# Altium schematic sheet POWER_SUPPLY.SchDoc
size A4; SheetNumber: 1; SheetTotal: 3
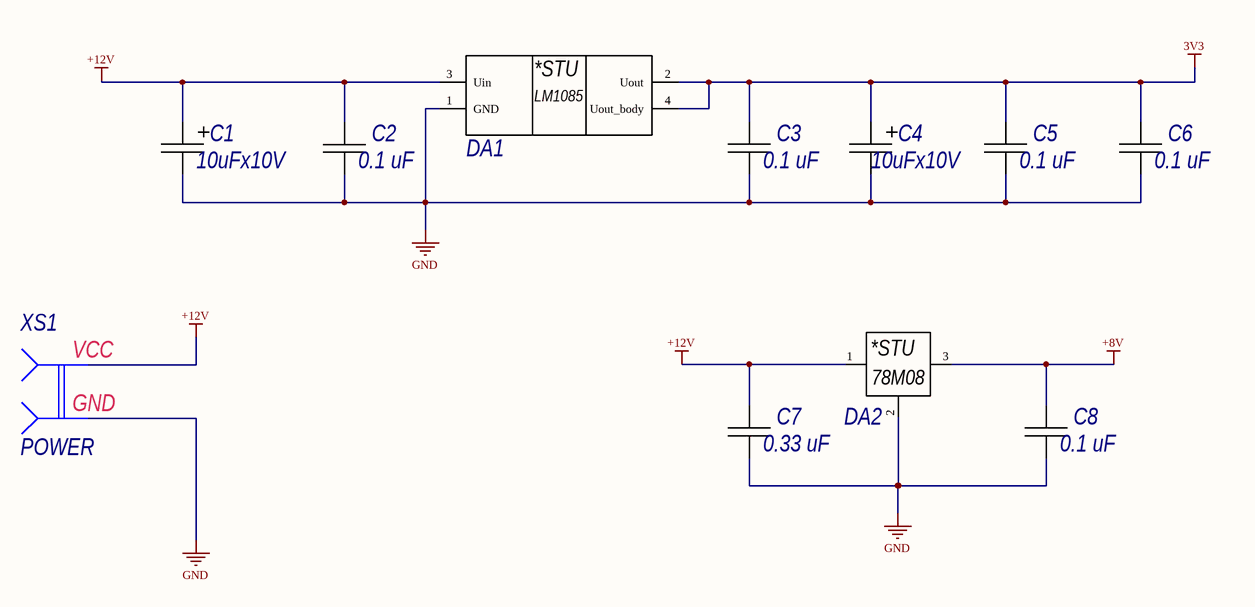
[diagram p0: POWER_SUPPLY.SchDoc]

## Parts
C1  10uFx10V
C2  0.1 uF  [C0805C]
C3  0.1 uF  [C0805C]
C4  10uFx10V
C5  0.1 uF  [C0805C]
C6  0.1 uF  [C0805C]
C7  0.33 uF  [C0805C]
C8  0.1 uF  [C0805C]
DA1  LM1085ISX-3.3  [LM1085ISX-3.3]  (value not drawn)
DA2  78M08CDT  [SC_TO-252AA]  (value not drawn)
XS1  POWER  [DG25C-B-02P-13]

## Nets
3V3: C3.2 C4.1 C5.2 C6.2 DA1.2(Uout) DA1.4(Uout_body)
+8V: C8.2 DA2.3(Out)
+12V: C1.1 C2.2 DA1.3(Uin) DA2.1(In) XS1.2
GND: C1.2 C2.1 C3.1 C4.2 C5.1 C6.1 C7.1 C8.1 DA1.1(GND) DA2.2(GND) XS1.1

Not connected (* = marked no-connect by the designer): C7 2

## Notes on the sheet
- (in symbol 78M08CDT) *STU; 78M08
- (in symbol CONNECT_PW) VCC; GND
- (in symbol LM1085ISX-3.3) *STU; LM1085

## Library data of the parts
C1 C4 = CAP_TECAP_A: Type: Конденсатор; Published: 20.08.2010; Publisher: Andrew Danich
C2 C3 C5-C8 = CAP_0805: Type: Конденсатор; Published: 18.05.2010; Publisher: Andrew Danich
XS1 = CONNECT_PW: Value: Connector; Published: 07.03.2013; Publisher: Andrew Danich; Type: Розетка
DA1 = LM1085ISX-3.3: Published: 31.07.2015; Publisher: Andrew Danich; Type: Микросхема
DA2 = 78M08CDT: Published: 13.08.2015; Publisher: Andrew Danich; Type: Микросхема